# EAGLE design BurnWireTimer (EAGLE 8.4.1)
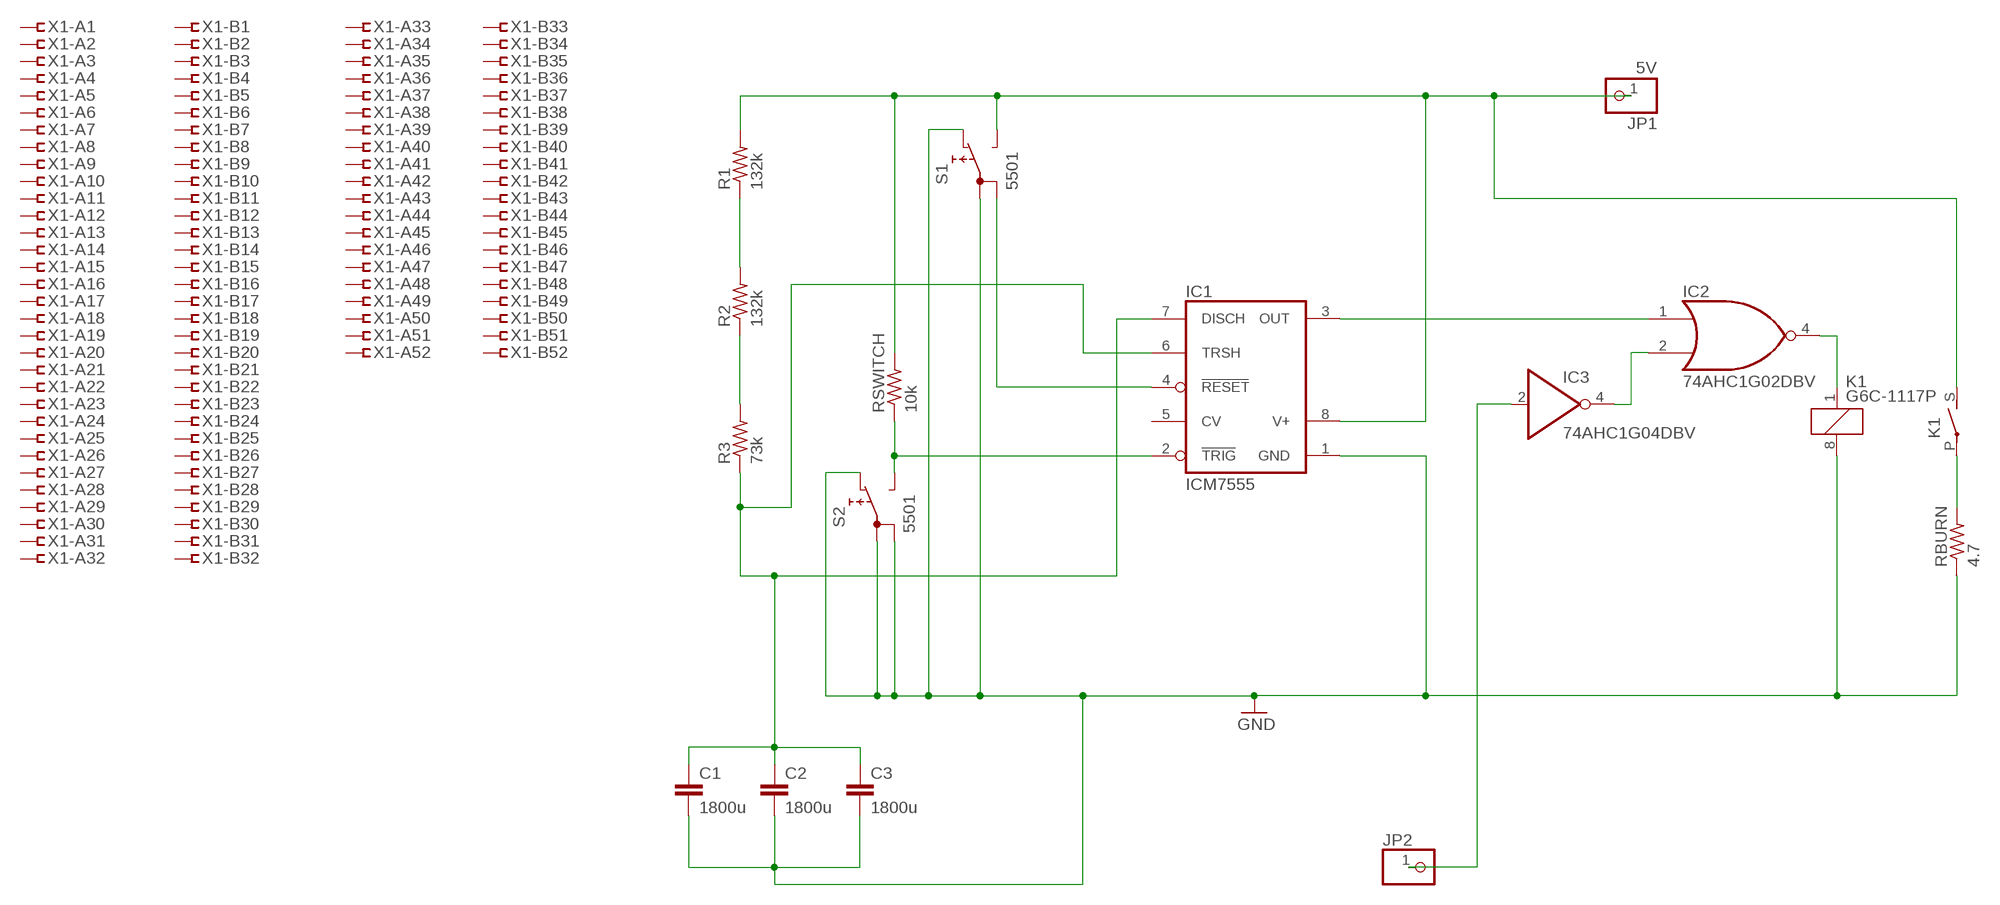
[diagram p0: schematic, sheet 1]

## Parts
C1  1800u  C5/3  [C5B3]
C2  1800u  C5/3  [C5B3]
C3  1800u  C5/3  [C5B3]
IC1  ICM7555  [DIL08]
IC2  74AHC1G02DBV  [SOT23-5]
IC3  74AHC1G04DBV  [SOT23-5]
JP1  5V  PINHD-1X1  [1X01]
JP2  PINHD-1X1  [1X01]
K1  G6C-1117P  [G6C-1117P]
R1  132k  R-US_0309/10  [0309/10]
R2  132k  R-US_0309/10  [0309/10]
R3  73k  R-US_0309/10  [0309/10]
RBURN  4.7  R-US_0309/10  [0309/10]
RSWITCH  10k  R-US_0309/10  [0309/10]
S1  5501  [5501]
S2  5501  [5501]
X1  1184C  [1184C]

## Nets
GND: C1.2 C2.2 C3.2 IC1.1(GND) K1.8 RBURN.1 S1.1A S1.NC S2.1A S2.1B S2.NC
N$1: IC2.4(O) K1.1
N$2: R1.1 R2.2
N$3: R2.1 R3.2
N$4: C1.1 C2.1 C3.1 IC1.6(TRSH) IC1.7(DISCH) R3.1
N$5: IC1.4(RESET) S1.1B
N$6: IC1.2(TRIG) RSWITCH.1 S2.NO
N$7: IC1.3(OUT) IC2.1(I0)
N$9: IC2.2(I1) IC3.4(O)
N$10: K1.P(2:P) RBURN.2
OBC: IC3.2(I) JP2.1
VCC: IC1.8(V+) JP1.1 K1.S(2:S) R1.2 RSWITCH.2 S1.NO
Unconnected: IC1.5(CV) X1.A1 X1.A2 X1.A3 X1.A4 X1.A5 X1.A6 X1.A7 X1.A8 X1.A9 X1.A10 X1.A11 X1.A12 X1.A13 X1.A14 X1.A15 X1.A16 X1.A17 X1.A18 X1.A19 X1.A20 X1.A21 X1.A22 X1.A23 X1.A24 X1.A25 X1.A26 X1.A27 X1.A28 X1.A29 X1.A30 X1.A31 X1.A32 X1.A33 X1.A34 X1.A35 X1.A36 X1.A37 X1.A38 X1.A39 X1.A40 X1.A41 X1.A42 X1.A43 X1.A44 X1.A45 X1.A46 X1.A47 X1.A48 X1.A49 X1.A50 X1.A51 X1.A52 X1.B1 X1.B2 X1.B3 X1.B4 X1.B5 X1.B6 X1.B7 X1.B8 X1.B9 X1.B10 X1.B11 X1.B12 X1.B13 X1.B14 X1.B15 X1.B16 X1.B17 X1.B18 X1.B19 X1.B20 X1.B21 X1.B22 X1.B23 X1.B24 X1.B25 X1.B26 X1.B27 X1.B28 X1.B29 X1.B30 X1.B31 X1.B32 X1.B33 X1.B34 X1.B35 X1.B36 X1.B37 X1.B38 X1.B39 X1.B40 X1.B41 X1.B42 X1.B43 X1.B44 X1.B45 X1.B46 X1.B47 X1.B48 X1.B49 X1.B50 X1.B51 X1.B52

## Power pins joined to a net without a drawn wire
GND: IC2.3(GND) IC3.3(GND)
VCC: IC2.5(VCC) IC3.5(VCC)

## Library data of the parts
C1-C3 = ECE2240+Project:C: CAPACITOR naming: grid - package width
IC1 = maxim:ICM7555: TIMER; MF: MAXIM; MPN: ICM7555IPA+; OC_FARNELL: 9663762; OC_NEWARK: 68K4387
IC2 = 74xx-little-us:74*1G02: 2-input NOR gate
IC3 = 74xx-little-de:74*1G04: INVERTER Gate
JP1 JP2 = pinhead:PINHD-1X1: PIN HEADER
K1 = relay:G6C-1117P: RELAY 1 x norm. open, 10 A/240 V, Omron; OC_FARNELL: unknown; OC_NEWARK: unknown
R1-R3 RBURN RSWITCH = ECE2240+Project:R-US_: RESISTOR, American symbol
S1 S2 = switch:55?: PUSHBUTTON SERIES 5500 SWITCHES Source: www.e-switch.com .. 5500.pdf
X1 = con-pc104:1184C: COMMCON CONNECTOR PC/104

## Board
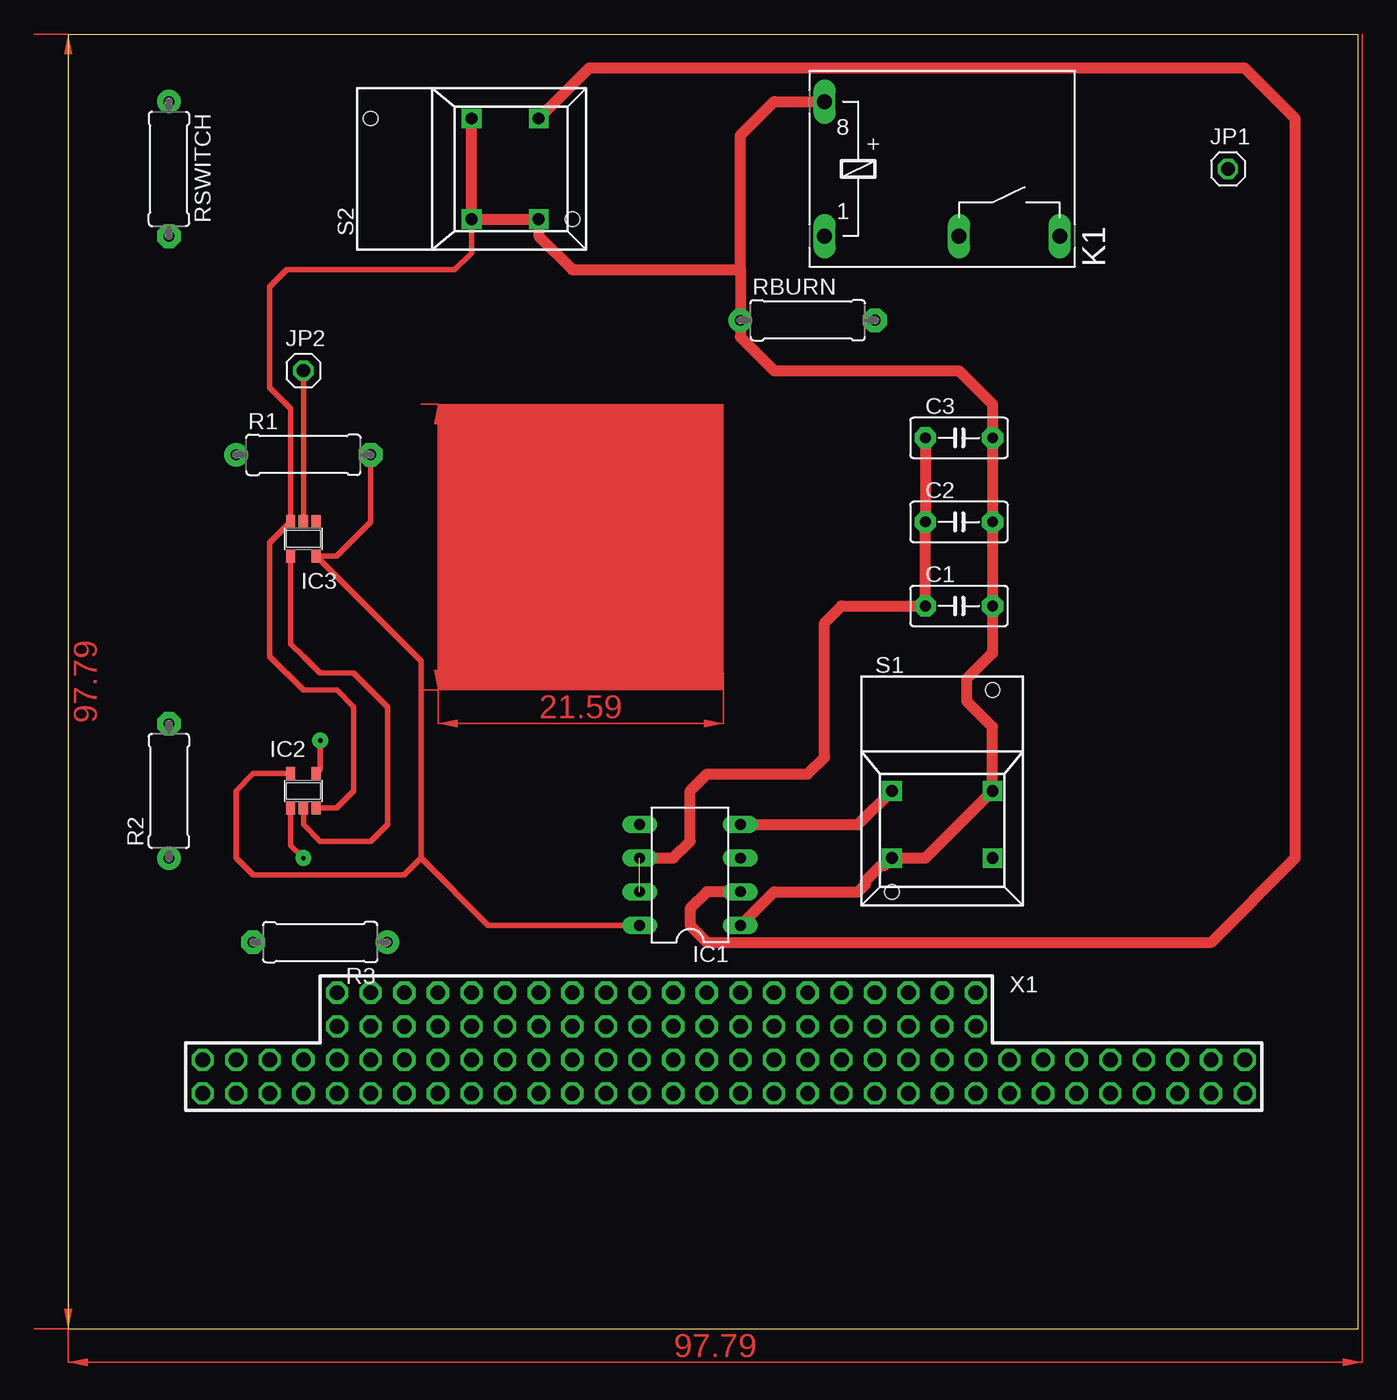
[diagram p1: board, top side]
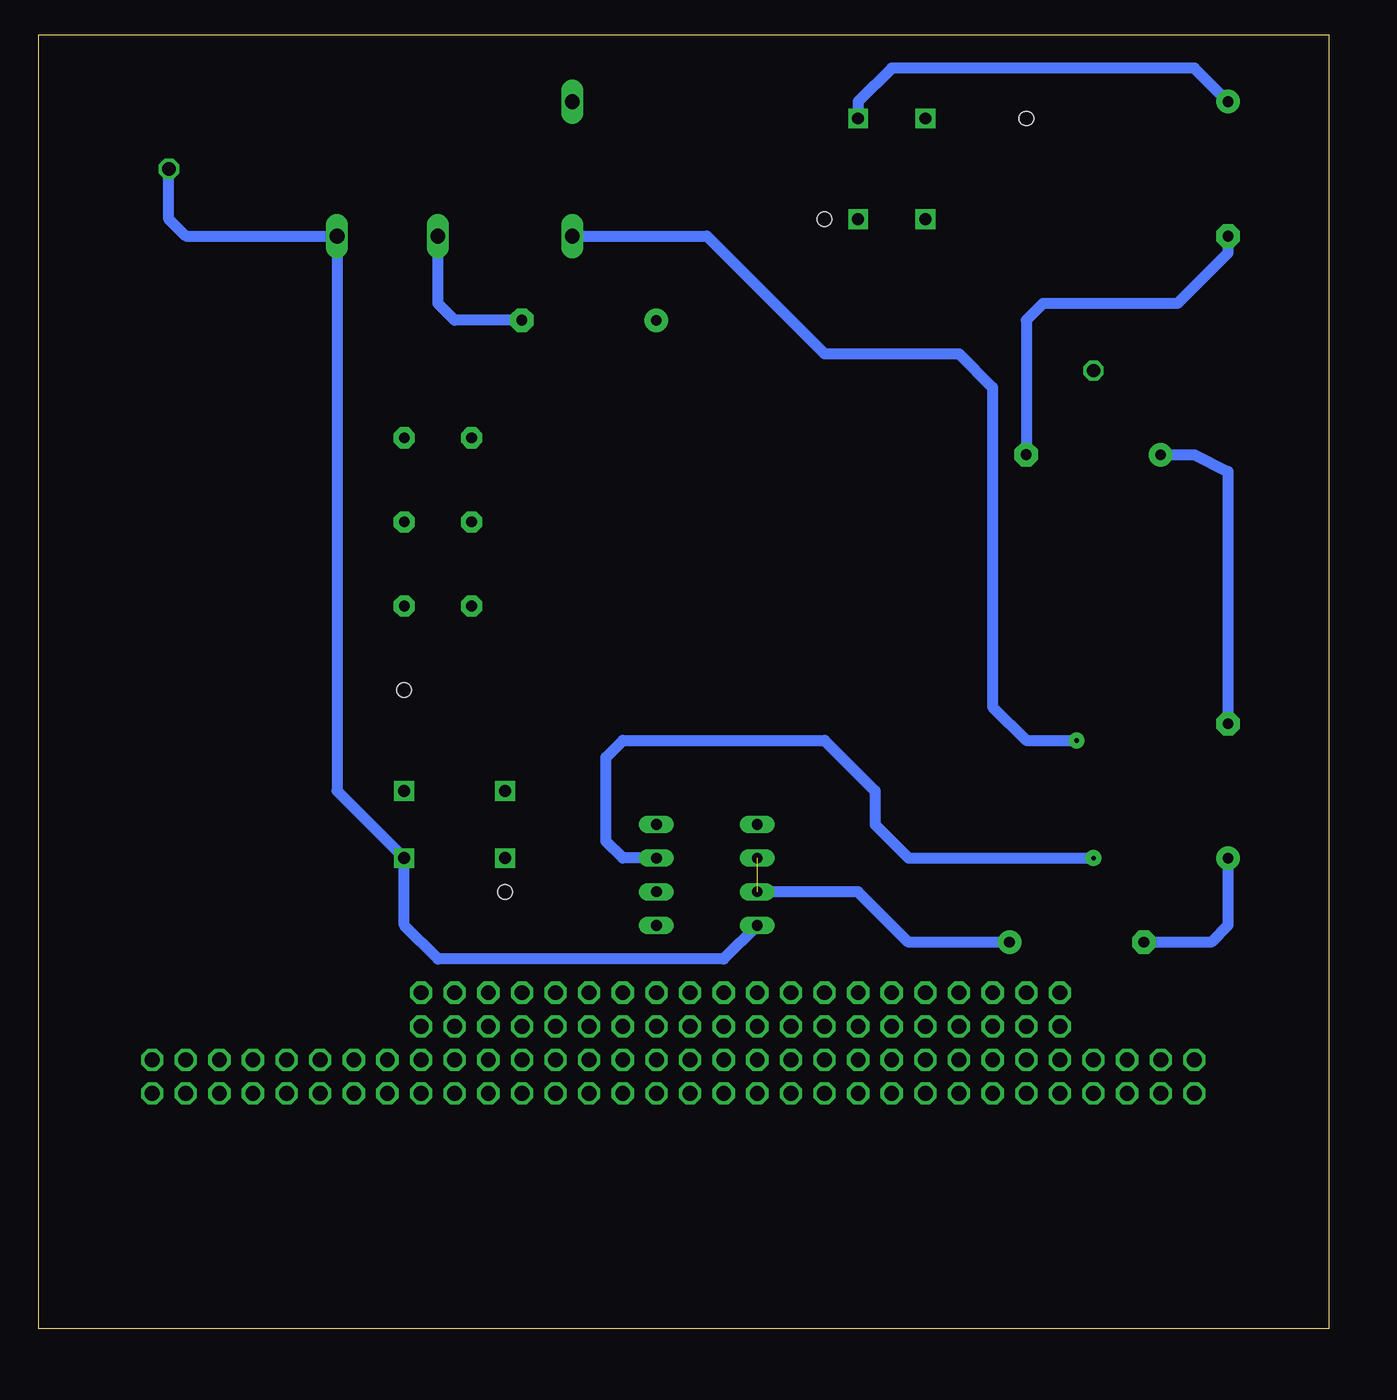
[diagram p2: board, bottom side, seen from below]

Size 97.46 x 97.78 mm. Coordinates in mm from the lower left corner, seen from the top.
Outline: 0,0 97.46,0 97.46,97.78 0,97.78 0,0
Copper layers (1*16): Top 0.035mm / dielectric 1.5mm / Bottom 0.035mm
Design rules "default": minimum track width 6mil, minimum drill 0.35mm, track to track 6mil, track to pad 6mil, pad to pad 6mil, via to via 6mil, smd to smd 6mil, copper to edge 40mil, drill to drill 6mil, minimum pad ring 10mil, minimum via ring 8mil, stop-mask expansion 4mil, vias tented up to drill 0mil, thermal gap 10mil

### Footprints (pad centres in the part's own frame; a part is rotated, then mirrored left to right if it is on the bottom)
C5B3 = drill 0.813 pad 1.6 octagon: 1 -2.54,0; 2 2.54,0
DIL08 = drill 0.813 long: 1 -3.81,-3.81; 2 -1.27,-3.81; 3 1.27,-3.81; 4 3.81,-3.81; 5 3.81,3.81; 6 1.27,3.81; 7 -1.27,3.81; 8 -3.81,3.81
SOT23-5 = smd 0.69 x 0.99: 1 -0.95,-1.29; 2 0,-1.29; 3 0.95,-1.29; 4 0.95,1.3; 5 -0.95,1.3
1X01 = drill 1.016 octagon: 1 0,0
G6C-1117P = drill 1.118 long: 1 -8.89,-5.08; 8 -8.89,5.08; P 1.27,-5.08; S 8.89,-5.08
0309/10 = drill 0.8 pad 1.778: 1 -5.08,0 | drill 0.813 pad 1.778 octagon: 2 5.08,0
5501 = drill 0.9 pad 1.5 square: 1A 0,3.81; 1B 0,-3.81; NC 5.08,-3.81; NO 5.08,3.81 | hole 1.1: -7.62,3.81; 7.62,-3.81
1184C = drill 1.118 octagon: A1 -39.37,-1.27; A2 -36.83,-1.27; A3 -34.29,-1.27; A4 -31.75,-1.27; A5 -29.21,-1.27; A6 -26.67,-1.27; A7 -24.13,-1.27; A8 -21.59,-1.27; A9 -19.05,-1.27; A10 -16.51,-1.27; A11 -13.97,-1.27; A12 -11.43,-1.27; A13 -8.89,-1.27; A14 -6.35,-1.27; A15 -3.81,-1.27; A16 -1.27,-1.27; A17 1.27,-1.27; A18 3.81,-1.27; A19 6.35,-1.27; A20 8.89,-1.27; A21 11.43,-1.27; A22 13.97,-1.27; A23 16.51,-1.27; A24 19.05,-1.27; A25 21.59,-1.27; A26 24.13,-1.27; A27 26.67,-1.27; A28 29.21,-1.27; A29 31.75,-1.27; A30 34.29,-1.27; A31 36.83,-1.27; A32 39.37,-1.27; A33 -29.21,3.81; A34 -26.67,3.81; A35 -24.13,3.81; A36 -21.59,3.81; A37 -19.05,3.81; A38 -16.51,3.81; A39 -13.97,3.81; A40 -11.43,3.81; A41 -8.89,3.81; A42 -6.35,3.81; A43 -3.81,3.81; A44 -1.27,3.81; A45 1.27,3.81; A46 3.81,3.81; A47 6.35,3.81; A48 8.89,3.81; A49 11.43,3.81; A50 13.97,3.81; A51 16.51,3.81; A52 19.05,3.81; B1 -39.37,-3.81; B2 -36.83,-3.81; B3 -34.29,-3.81; B4 -31.75,-3.81; B5 -29.21,-3.81; B6 -26.67,-3.81; B7 -24.13,-3.81; B8 -21.59,-3.81; B9 -19.05,-3.81; B10 -16.51,-3.81; B11 -13.97,-3.81; B12 -11.43,-3.81; B13 -8.89,-3.81; B14 -6.35,-3.81; B15 -3.81,-3.81; B16 -1.27,-3.81; B17 1.27,-3.81; B18 3.81,-3.81; B19 6.35,-3.81; B20 8.89,-3.81; B21 11.43,-3.81; B22 13.97,-3.81; B23 16.51,-3.81; B24 19.05,-3.81; B25 21.59,-3.81; B26 24.13,-3.81; B27 26.67,-3.81; B28 29.21,-3.81; B29 31.75,-3.81; B30 34.29,-3.81; B31 36.83,-3.81; B32 39.37,-3.81; B33 -29.21,1.27; B34 -26.67,1.27; B35 -24.13,1.27; B36 -21.59,1.27; B37 -19.05,1.27; B38 -16.51,1.27; B39 -13.97,1.27; B40 -11.43,1.27; B41 -8.89,1.27; B42 -6.35,1.27; B43 -3.81,1.27; B44 -1.27,1.27; B45 1.27,1.27; B46 3.81,1.27; B47 6.35,1.27; B48 8.89,1.27; B49 11.43,1.27; B50 13.97,1.27; B51 16.51,1.27; B52 19.05,1.27

### Placement (x,y rotation side)
C1  67.31,54.61 0 top
C2  67.31,60.96 0 top
C3  67.31,67.31 0 top
IC1  46.99,34.29 90 top
IC2  17.78,40.64 0 top
IC3  17.78,59.69 180 top
JP1  87.63,87.63 0 top
JP2  17.78,72.39 0 top
K1  66.04,87.63 0 top
R1  17.78,66.04 0 top
R2  7.62,40.64 90 top
R3  19.05,29.21 180 top
RBURN  55.88,76.2 0 top
RSWITCH  7.62,87.63 270 top
S1  66.04,40.64 270 top
S2  30.48,87.63 0 top
X1  49.53,21.59 0 top

### Tracks (layer width: path | path; a pad name or v marks a point on that pad's centre or on a via)
GND
  Top 0.406: S2.1B 30.48,81.28 29.21,80.01 16.51,80.01 15.24,78.74 15.24,71.12 16.83,69.53 IC3.3 15.24,59.39 15.24,50.8 17.78,48.26 20.32,48.26 21.59,46.99 21.59,40.64 20.3,39.35 IC2.3
  Top 0.813: S2.1A S2.1B S2.NC 35.56,82.55 38.1,80.01 50.8,80.01 | 50.8,80.01 RBURN.1 50.8,74.93 53.34,72.39 67.31,72.39 69.85,69.85 C3.2 C2.2 C1.2 69.85,51.05 67.88,49.08 67.88,47.44 69.85,45.47 S1.1A 64.77,35.56 S1.NC 61.66,34.99 61.41,34.99 60.26,33.84 60.26,33.59 59.69,33.02 53.34,33.02 IC1.1 | 50.8,80.01 50.8,90.17 53.34,92.71 K1.8
N$1  (via drill 0.35 pad 1.2)
  Top 0.406: IC2.4 19.05,42.26 v19.05,44.45
  Bottom 0.813: K1.1 46.99,82.55 38.1,73.66 27.94,73.66 25.4,71.12 25.4,46.99 22.86,44.45 v19.05,44.45
N$2
  Bottom 0.813: R1.1 10.16,66.04 7.62,64.77 R2.2
N$3
  Bottom 0.813: R2.1 7.62,30.48 8.89,29.21 R3.2
N$4  (1 unrouted)
  Top 0.813: C3.1 C2.1 C1.1 58.42,54.61 57.15,53.34 57.15,43.18 55.88,41.91 48.26,41.91 46.99,40.64 46.99,36.83 45.72,35.56 IC1.6
  Bottom 0.813: R3.1 31.75,29.21 35.56,33.02 IC1.7
N$5
  Top 0.813: IC1.4 59.69,38.1 S1.1B
N$6
  Top 0.813: IC1.2 48.26,33.02 46.99,31.75 46.99,30.48 48.26,29.21 86.36,29.21 92.71,35.56 92.71,91.44 88.9,95.25 39.37,95.25 S2.NO
  Bottom 0.813: RSWITCH.1 10.16,95.25 33.02,95.25 35.56,92.71 S2.NO
N$7  (via drill 0.35 pad 1.2)
  Top 0.406: IC2.1 16.83,36.51 v17.78,35.56
  Bottom 0.813: IC1.3 53.34,35.56 54.61,36.83 54.61,43.18 53.34,44.45 38.1,44.45 34.29,40.64 34.29,38.1 31.75,35.56 v17.78,35.56
N$9
  Top 0.406: IC3.4 16.83,51.75 17.78,50.8 19.05,49.53 21.59,49.53 24.13,46.99 24.13,38.1 22.86,36.83 19.05,36.83 17.78,38.1 IC2.2
N$10
  Bottom 0.813: RBURN.2 66.04,76.2 67.31,77.47 K1.P
OBC
  Top 0.406: IC3.2 JP2.1
VCC
  Top 0.406: R1.2 22.86,60.96 20.29,58.39 IC3.5 26.67,50.45 26.67,35.56 | 26.67,35.56 25.4,34.29 13.97,34.29 12.7,35.56 12.7,40.64 14,41.94 IC2.5 | 26.67,35.56 31.75,30.48 IC1.8
  Bottom 0.813: JP1.1 87.63,83.82 86.36,82.55 K1.S 74.93,40.64 S1.NO 69.85,30.48 67.31,27.94 45.72,27.94 IC1.8 | RSWITCH.2 7.62,81.28 11.43,77.47 21.59,77.47 22.86,76.2 R1.2
(copper drawn outside any net)
  shapes: Top area x5